# Altium schematic sheet Main.SchDoc
size B; Organization: Altium Limited; Address1: L3, 12a Rodborough Rd; Address2: Frenchs Forest; Address3: NSW; Address4: Australia 2086
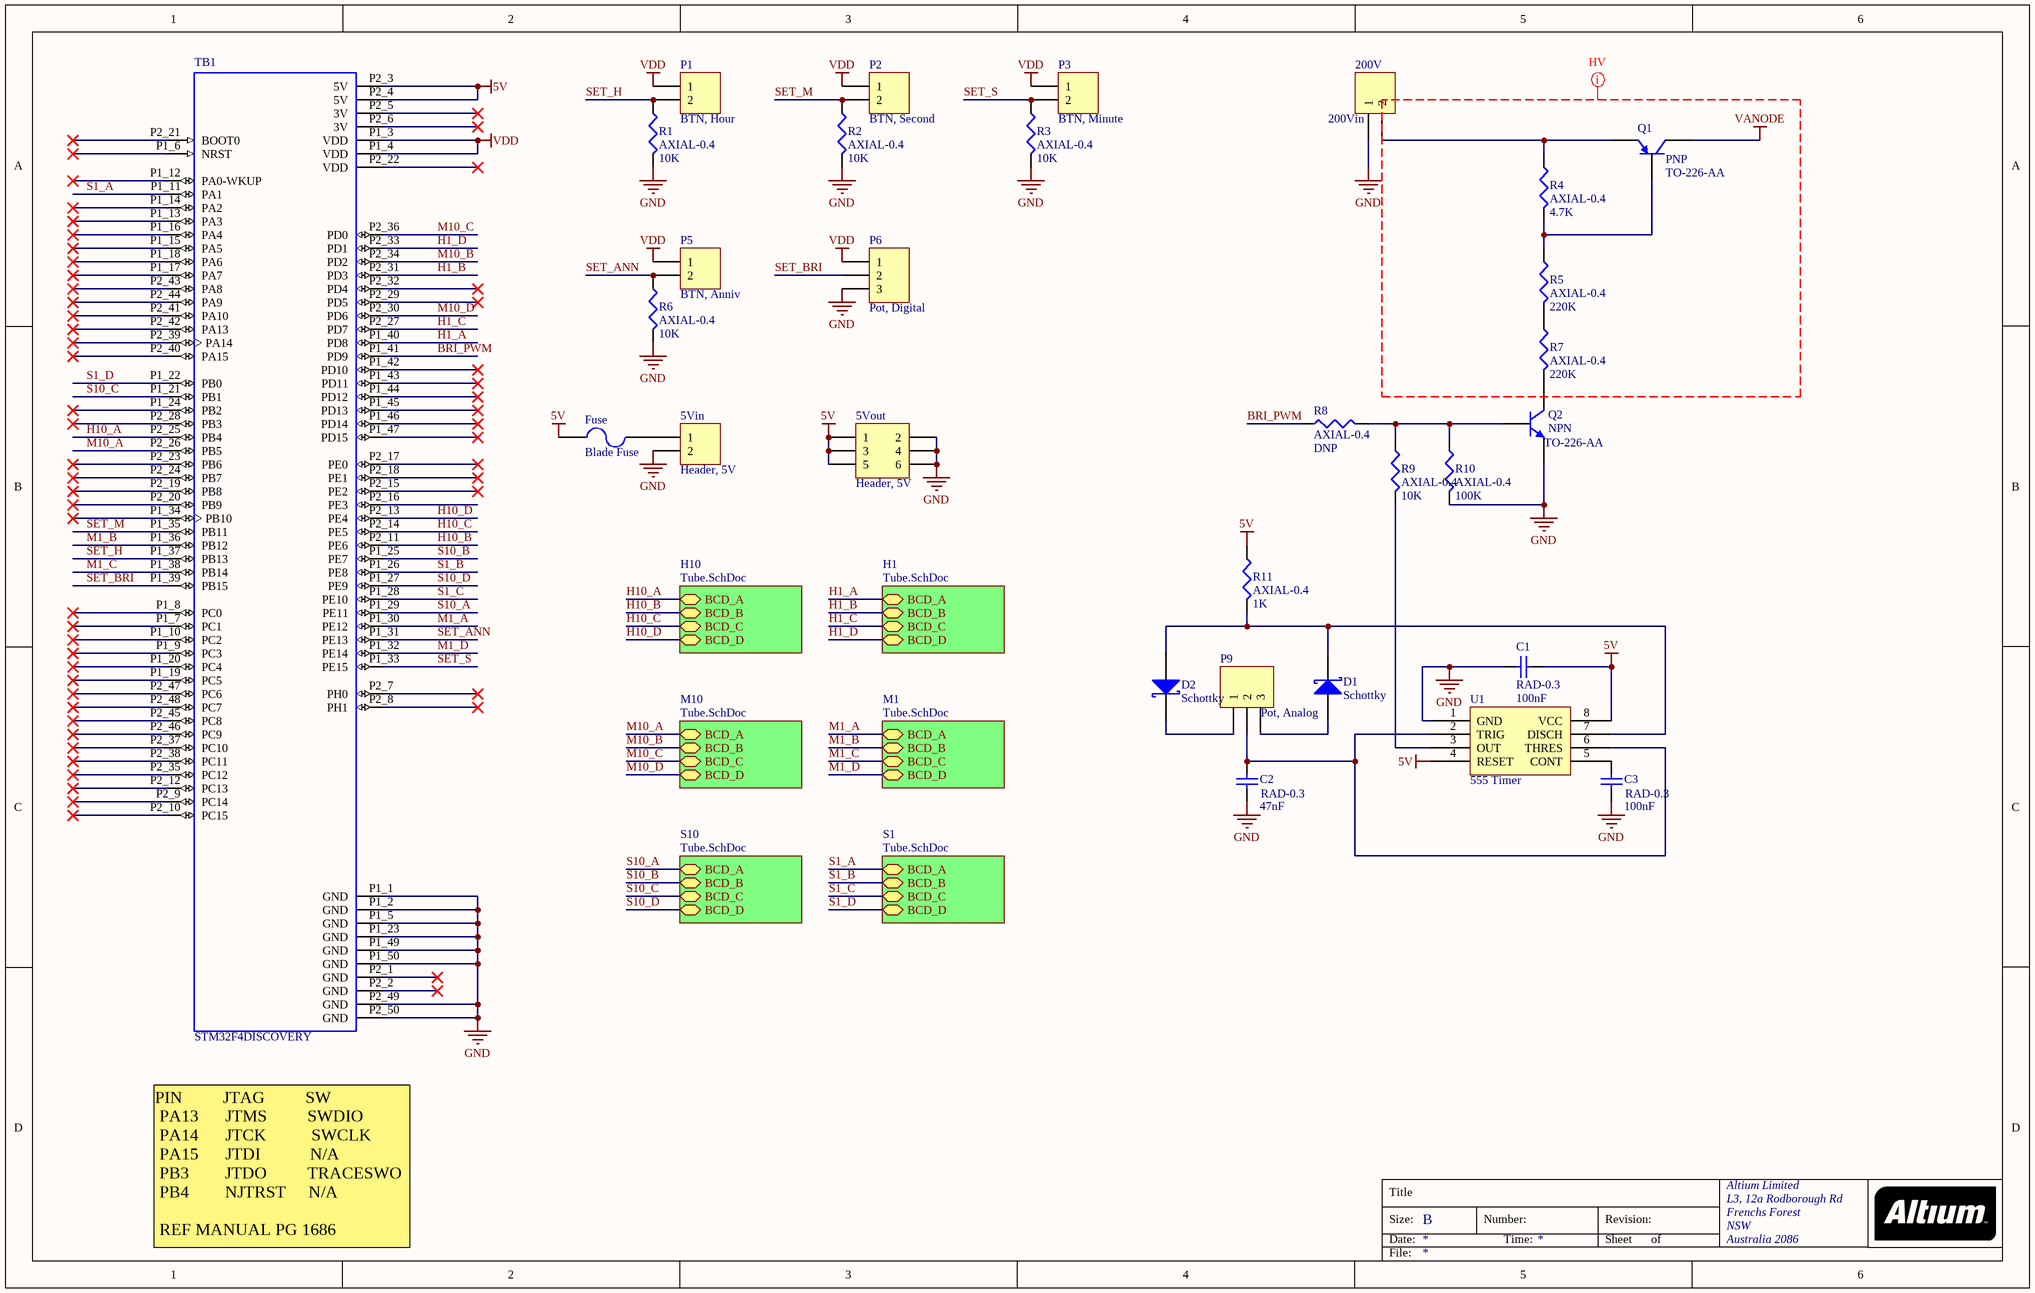
[diagram p0: Main.SchDoc]

## Parts
5Vin  Header, 5V  [HDR1X2]
5Vout  Header, 5V  [HDR2X3]
200V  200Vin  [HDR1X2H]
C1  value 100nF  [RAD-0.3]  (hidden comment: Cap)
C2  value 47nF  [RAD-0.3]
C3  value 100nF  [RAD-0.3]  (hidden comment: Cap)
D1  Schottky  [AXIAL-0.4]
D2  Schottky  [AXIAL-0.4]
Fuse  Blade Fuse  [FUSEHOLDER]
P1  BTN, Hour  [HDR1X2]
P2  BTN, Second  [HDR1X2]
P3  BTN, Minute  [HDR1X2]
P5  BTN, Anniv  [HDR1X2]
P6  Pot, Digital  [HDR1X3]
P9  Pot, Analog  [HDR1X3]
Q1  PNP  PackageReference: TO-226-AA  [T0-226-BEND]
Q2  NPN  PackageReference: TO-226-AA  [T0-226-BEND]
R1  AXIAL-0.4  value 10K  [AXIAL-0.4]
R2  AXIAL-0.4  value 10K  [AXIAL-0.4]
R3  AXIAL-0.4  value 10K  [AXIAL-0.4]
R4  AXIAL-0.4  value 4.7K  [AXIAL-0.4]
R5  AXIAL-0.4  value 220K  [AXIAL-0.4]
R6  AXIAL-0.4  value 10K  [AXIAL-0.4]
R7  AXIAL-0.4  value 220K  [AXIAL-0.4]
R8  AXIAL-0.4  value DNP  [AXIAL-0.4]
R9  AXIAL-0.4  value 10K  [AXIAL-0.4]
R10  AXIAL-0.4  value 100K  [AXIAL-0.4]
R11  AXIAL-0.4  value 1K  [AXIAL-0.4]
TB1  STM32F4DISCOVERY  [*MODULE_STM32F4DISCOVERY_STM32F4DISCOVERY_Primary]
U1  555 Timer  [DIP-8]

## Sub-sheets
H1 = Tube.SchDoc: BCD_A, BCD_B, BCD_C, BCD_D
H10 = Tube.SchDoc: BCD_A, BCD_B, BCD_C, BCD_D
M1 = Tube.SchDoc: BCD_A, BCD_B, BCD_C, BCD_D
M10 = Tube.SchDoc: BCD_A, BCD_B, BCD_C, BCD_D
S1 = Tube.SchDoc: BCD_A, BCD_B, BCD_C, BCD_D
S10 = Tube.SchDoc: BCD_A, BCD_B, BCD_C, BCD_D

## Nets
5V: 5Vout.1 5Vout.3 5Vout.5 C1.1 Fuse.2 R11.1 TB1.P2_3(5V) TB1.P2_4(5V) U1.4(RESET) U1.8(VCC)
GND: 5Vin.2 5Vout.2 5Vout.4 5Vout.6 200V.1 C1.2 C2.1 C3.1 P6.3 Q2.3(E) R1.2 R2.2 R3.2 R6.2 R10.2 TB1.P1_1(GND) TB1.P1_2(GND) TB1.P1_5(GND) TB1.P1_23(GND) TB1.P1_49(GND) TB1.P1_50(GND) TB1.P2_49(GND) TB1.P2_50(GND) U1.1(GND)
VANODE: Q1.1(C)
VDD: P1.1 P2.1 P3.1 P5.1 P6.1 TB1.P1_3(VDD) TB1.P1_4(VDD)
BRI_PWM: R8.1 TB1.P1_41(PD9)
H1_A: TB1.P1_40(PD8) ; sheet H1/BCD_A
H1_B: TB1.P2_31(PD3) ; sheet H1/BCD_B
H1_C: TB1.P2_27(PD7) ; sheet H1/BCD_C
H1_D: TB1.P2_33(PD1) ; sheet H1/BCD_D
H10_A: TB1.P2_25(PB4) ; sheet H10/BCD_A
H10_B: TB1.P2_11(PE6) ; sheet H10/BCD_B
H10_C: TB1.P2_14(PE5) ; sheet H10/BCD_C
H10_D: TB1.P2_13(PE4) ; sheet H10/BCD_D
M1_A: TB1.P1_30(PE12) ; sheet M1/BCD_A
M1_B: TB1.P1_36(PB12) ; sheet M1/BCD_B
M1_C: TB1.P1_38(PB14) ; sheet M1/BCD_C
M1_D: TB1.P1_32(PE14) ; sheet M1/BCD_D
M10_A: TB1.P2_26(PB5) ; sheet M10/BCD_A
M10_B: TB1.P2_34(PD2) ; sheet M10/BCD_B
M10_C: TB1.P2_36(PD0) ; sheet M10/BCD_C
M10_D: TB1.P2_30(PD6) ; sheet M10/BCD_D
S1_A: TB1.P1_11(PA1) ; sheet S1/BCD_A
S1_B: TB1.P1_26(PE8) ; sheet S1/BCD_B
S1_C: TB1.P1_28(PE10) ; sheet S1/BCD_C
S1_D: TB1.P1_22(PB0) ; sheet S1/BCD_D
S10_A: TB1.P1_29(PE11) ; sheet S10/BCD_A
S10_B: TB1.P1_25(PE7) ; sheet S10/BCD_B
S10_C: TB1.P1_21(PB1) ; sheet S10/BCD_C
S10_D: TB1.P1_27(PE9) ; sheet S10/BCD_D
SET_ANN: P5.2 R6.1 TB1.P1_31(PE13)
SET_BRI: P6.2 TB1.P1_39(PB15)
SET_H: P1.2 R1.1 TB1.P1_37(PB13)
SET_M: P2.2 R2.1 TB1.P1_35(PB11)
SET_S: P3.2 R3.1 TB1.P1_33(PE15)
Net5Vin_1: 5Vin.1 Fuse.1
Net200V_2: 200V.2 Q1.3(E) R4.1
NetC2_2: C2.2 P9.2 U1.2(TRIG) U1.6(THRES)
NetC3_2: C3.2 U1.5(CONT)
NetD1_1: D1.1(A) P9.3
NetD1_2: D1.2(K) D2.1(A) R11.2 U1.7(DISCH)
NetD2_2: D2.2(K) P9.1
NetQ1_2: Q1.2(B) R4.2 R5.1
NetQ2_1: Q2.1(C) R7.2
NetQ2_2: Q2.2(B) R8.2 R9.1 R10.1
NetR5_2: R5.2 R7.1
NetR9_2: R9.2 U1.3(OUT)

Not connected (* = marked no-connect by the designer): TB1 P1_6(NRST)* P1_7(PC1)* P1_8(PC0)* P1_9(PC3)* P1_10(PC2)* P1_12(PA0-WKUP)* P1_13(PA3)* P1_14(PA2)* P1_15(PA5)* P1_16(PA4)* P1_17(PA7)* P1_18(PA6)* P1_19(PC5)* P1_20(PC4)* P1_24(PB2)* P1_34(PB10)* P1_42(PD10)* P1_43(PD11)* P1_44(PD12)* P1_45(PD13)* P1_46(PD14)* P1_47(PD15)* P2_1(GND)* P2_2(GND)* P2_5(3V)* P2_6(3V)* P2_7(PH0)* P2_8(PH1)* P2_9(PC14)* P2_10(PC15)* P2_12(PC13)* P2_15(PE2)* P2_16(PE3) P2_17(PE0)* P2_18(PE1)* P2_19(PB8)* P2_20(PB9)* P2_21(BOOT0)* P2_22(VDD)* P2_23(PB6)* P2_24(PB7)* P2_28(PB3)* P2_29(PD5)* P2_32(PD4)* P2_35(PC12)* P2_37(PC10)* P2_38(PC11)* P2_39(PA14)* P2_40(PA15)* P2_41(PA10)* P2_42(PA13)* P2_43(PA8)* P2_44(PA9)* P2_45(PC8)* P2_46(PC9)* P2_47(PC6)* P2_48(PC7)*

## Layout directives
net class HV; rule Clearance Constraint [Clearance = 40mil]: VANODE

## Notes on the sheet
- PIN         JTAG         SW
  PA13      JTMS         SWDIO
  PA14      JTCK          SWCLK
  PA15      JTDI           N/A
  PB3        JTDO         TRACESWO
  PB4        NJTRST     N/A
  REF MANUAL PG 1686
- Title
- Size:
- Date:
- B
- Number:
- Time:
- Revision:
- Sheet
- of
- File:

## Library data of the parts
5Vin P1-P3 P5 = Header 2: Header, 2-Pin; LatestRevisionDate: 17-Jul-2002; LatestRevisionNote: Re-released for DXP Platform.; Publisher: Altium Limited
5Vout = Header 3X2: Header, 3-Pin, Dual row; LatestRevisionDate: 17-Jul-2002; LatestRevisionNote: Re-released for DXP Platform.; Publisher: Altium Limited
200V = Header 2H: Header, 2-Pin, Right Angle; LatestRevisionDate: 17-Jul-2002; LatestRevisionNote: Re-released for DXP Platform.; Publisher: Altium Limited
C1-C3 = Cap: Capacitor; Published: 8-Jun-2000; LatestRevisionDate: 17-Jul-2002; LatestRevisionNote: Re-released for DXP Platform.; PackageReference: RAD-0.3; Publisher: Altium Limited; PackageDescription: Radial Cap, Thru-Hole; 2 Leads; 0.3 in Pin Spacing
D1 D2 = D Schottky: Schottky Diode; Published: 8-Jun-2000; LatestRevisionDate: 17-Jul-2002; LatestRevisionNote: Re-released for DXP Platform.; PackageReference: SMB; Publisher: Altium Limited; PackageDescription: DO-214-AA/SMB; 2 C-Bend Leads; Body 5.3 x 3.6 mm, inc. leads (LxW); Code_JEDEC: DO-214-AA
Fuse = Fuse 2: Fuse; Published: 8-Jun-2000; LatestRevisionDate: 17-Jul-2002; LatestRevisionNote: Re-released for DXP Platform.; PackageReference: PIN-W2/E2.8; Publisher: Altium Limited; PackageDescription: Thru-Hole; 2 Leads
P6 P9 = Header 3: Header, 3-Pin; LatestRevisionDate: 17-Jul-2002; LatestRevisionNote: Re-released for DXP Platform.; Publisher: Altium Limited
Q1 = PNP: PNP Bipolar Transistor; Published: 8-Jun-2000; LatestRevisionDate: 29-May-2009; LatestRevisionNote: IPC-7351 Footprint Added.; PackageVersion: Aug-1999; Publisher: Altium Limited; PackageDescription: TO, Flat Index; 3 In-Line, Axial Leads; Body Dia. 4.8mm; Leads 0.55 x 0.51 mm (max)
Q2 = NPN: NPN Bipolar Transistor; Published: 8-Jun-2000; LatestRevisionDate: 17-Jul-2002; LatestRevisionNote: Re-released for DXP Platform.; Publisher: Altium Limited; PackageDescription: TO, Flat Index; 3 In-Line, Axial Leads; Body Dia. 4.8mm; Leads 0.55 x 0.51 mm (max); Code_JEDEC: TO-226-AA
R1-R11 = Res3: Resistor; Published: 8-Jun-2000; LatestRevisionDate: 29-May-2009; LatestRevisionNote: IPC-7351 Footprint Added.; PackageReference: AXIAL-0.4; Publisher: Altium Limited; PackageDescription: Chip Resistor
TB1 = STM32F4DISCOVERY: Development kit: ARM ST; pin strips, pin header; No.of; MF: STMicroelectronics; Availability: Unavailable; Package: None; SnapEDA_Link: https://www.snapeda.com/parts/STM32F4DISCOVERY/STMicroelectronics/view-part/?ref=snap; Price: None; MP: STM32F4DISCOVERY; Value: *
U1 = 555 Timer: PartNumber: NE555P